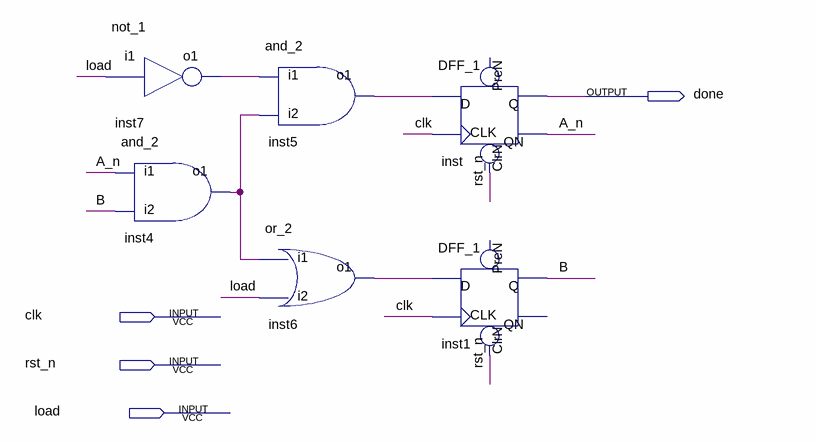
[diagram p0: schematic sheet]
// Quartus schematic Controller_done.bdf as structural Verilog: 6 symbols, 4 pins
module Controller_done (
  input  clk,
  input  rst_n,
  input  load,
  output done
);

  wire A_n, B, inst4_o1, inst5_o1, inst6_o1, inst7_o1;

  not_1 inst7 (.i1(load), .o1(inst7_o1));
  and_2 inst4 (.i1(A_n), .i2(B), .o1(inst4_o1));
  and_2 inst5 (.i1(inst7_o1), .i2(inst4_o1), .o1(inst5_o1));
  or_2 inst6 (.i1(inst4_o1), .i2(load), .o1(inst6_o1));
  DFF_1 inst (.CLK(clk), .D(inst5_o1), .ClrN(rst_n), .QN(A_n), .Q(done));  // open: PreN
  DFF_1 inst1 (.CLK(clk), .D(inst6_o1), .ClrN(rst_n), .Q(B));  // open: PreN, QN
endmodule
